# EasyEDA Pro project MasterCtrl_v1_0_4.eprj, board VicePCB
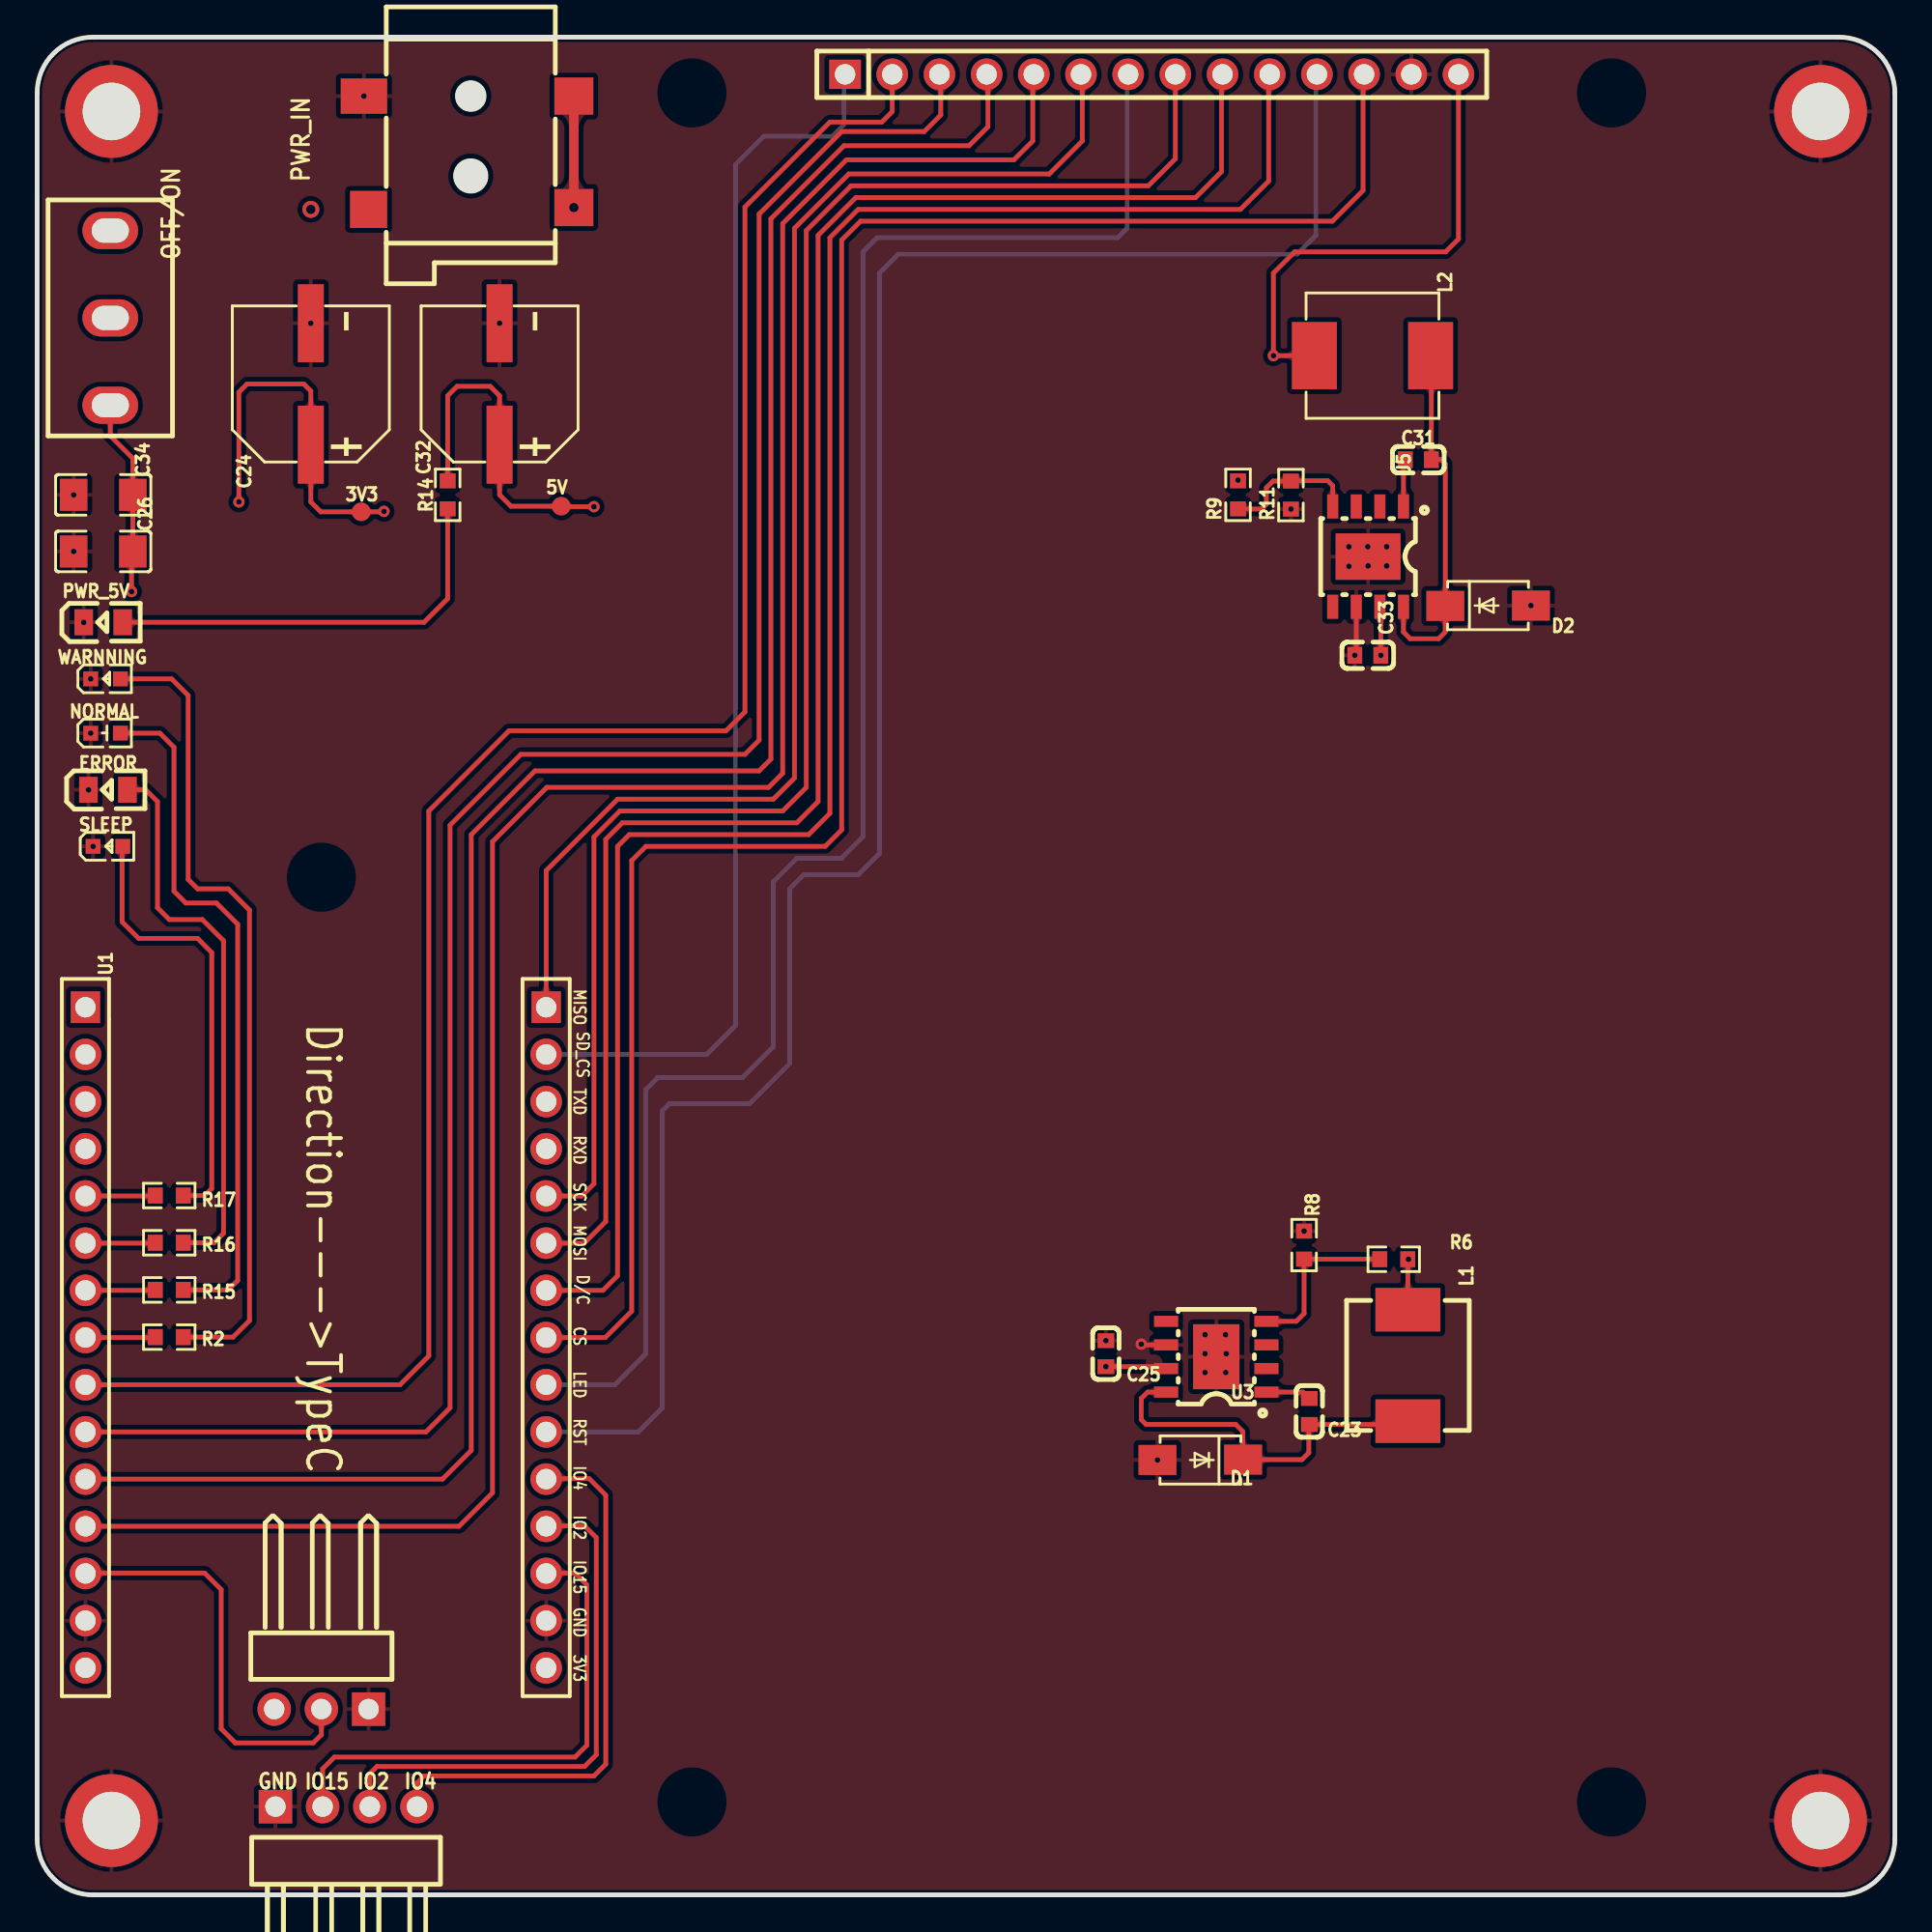
[diagram p6: board, top side]
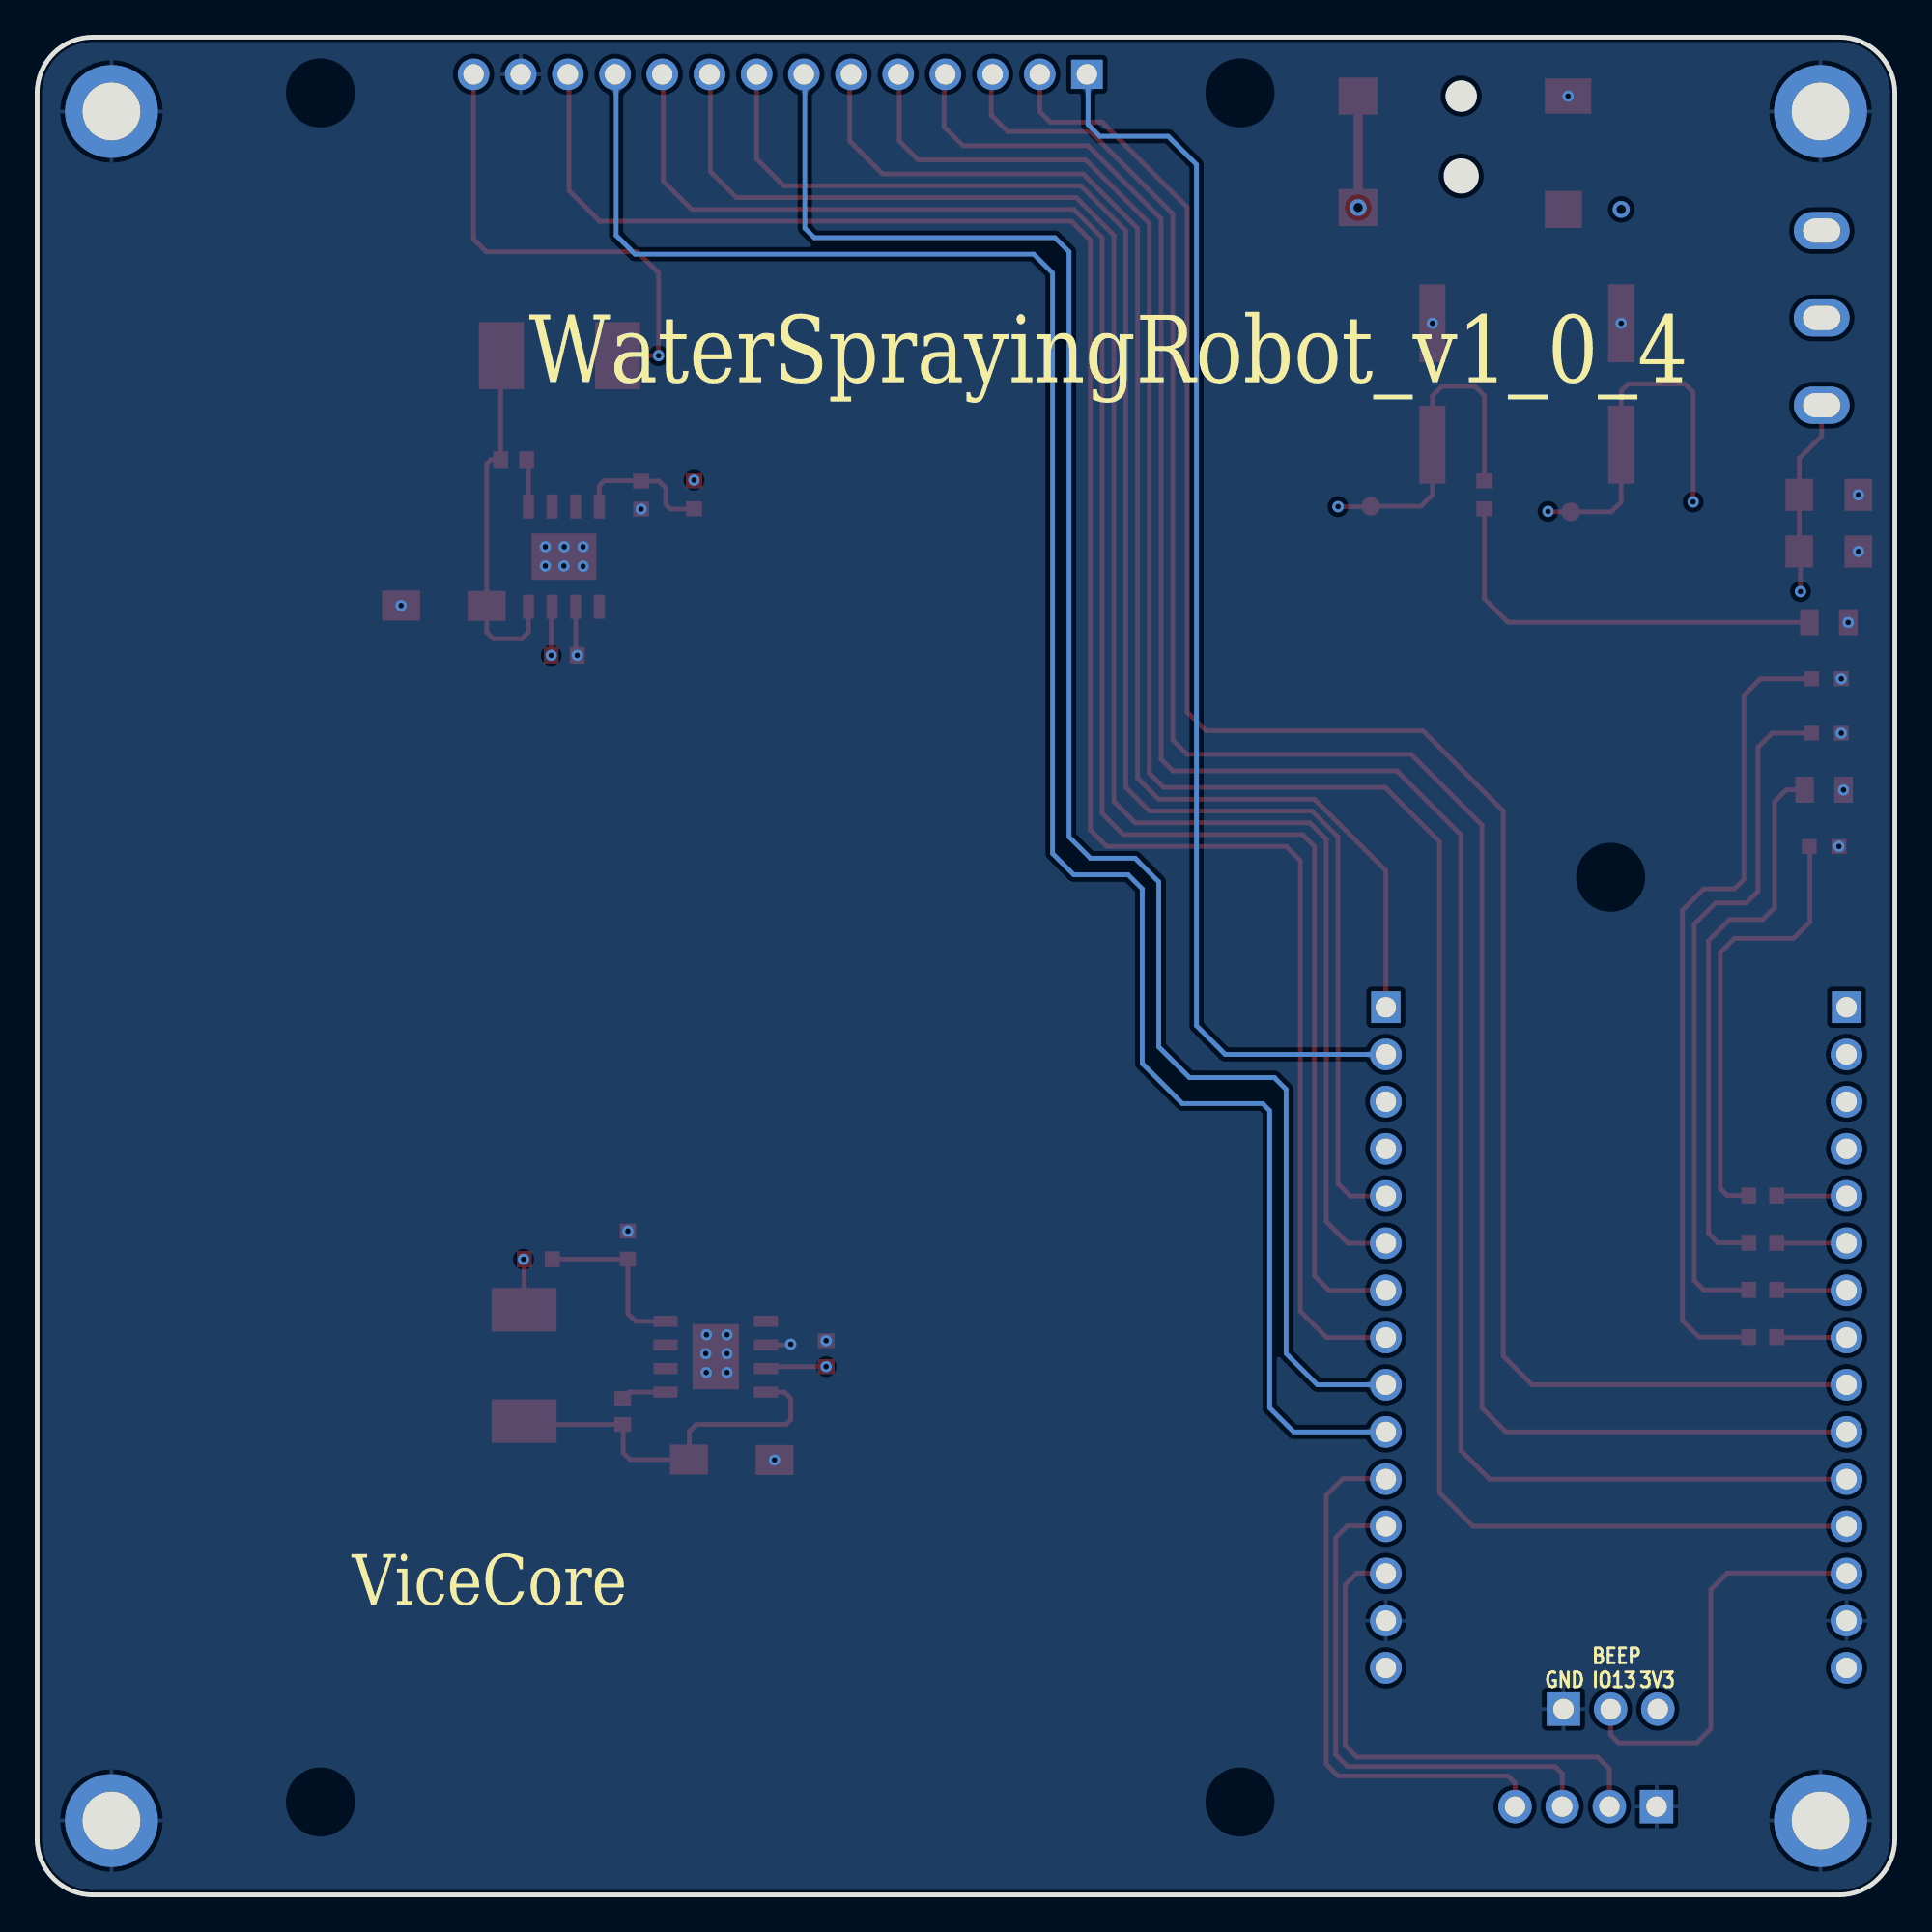
[diagram p7: board, bottom side, seen from below]

Outline 100 x 100 mm; copper layers: Top Layer, GND, PWR, Bottom Layer. Coordinates in mm from the lower left corner of the outline.
Outline path: 0,97 0,3 arc(0.88,0.88) 3,0 97,0 arc(99.12,0.88) 100,3 100,97 arc(99.12,99.12) 97,100 3,100 arc(0.88,99.12) 0,97
Stack: Top Layer 0.035mm 外层铜厚1oz / Dielectric1 0.2104mm 7628 RC49% 8.6mil / GND 0.0152mm 内层铜厚 / Dielectric2 1.065mm 1.1mm H/HOZ Copper / PWR 0.0152mm 内层铜厚 / Dielectric3 0.2104mm 7628 RC49% 8.6mil / Bottom Layer 0.035mm 外层铜厚1oz

## Design rules (mm)
template: JLCPCB Capability(Two Layers Board)
spacing copperThickness1oz (default): track to track 0.102, other pairs 0.152 to 0.3
spacing copperThickness2oz: track to track 0.203, other pairs 0.152 to 0.3
track width copperThickness1oz (default): min 0.127, default 0.254, max 2.54
track width copperThickness2oz: min 0.203, default 0.254, max 2.54
differential pair differentialPair (default): width min 0.127, default 0.254, max 2.54; gap min 0.152, default 0.152
via viaSize (default): diameter min 0.5, default 0.61, max 10; hole min 0.3, default 0.305, max 6.3

## Placement (name value [footprint] x y rotation side)
3V3  -  [Test-Point-0.5mm]  17.45 74.45 0 top
5V  -  [Test-Point-0.5mm]  28.21 74.75 270 top
C23  10nF  [C0603]  68.48 26.02 90 top
C24  220uF  [CAP-SMD_BD8.0-L8.3-W8.3-FD]  14.73 81.33 90 top
C25  100nF  [C0603]  57.53 29.13 90 top
C26  10uF  [C1206]  3.56 72.31 0 top
C31  10nF  [C0603]  74.35 77.25 180 top
C32  220uF  [CAP-SMD_BD8.0-L8.3-W8.3-FD]  24.89 81.33 90 top
C33  100nF  [C0603]  71.63 66.73 180 top
C34  10uF  [C1206]  3.56 75.36 0 top
D1  SS54  [SMA_L4.3-W2.6-LS5.0-FD]  62.61 23.42 0 top
D2  SS54  [SMA_L4.3-W2.6-LS5.0-FD]  78.1 69.39 180 top
ERROR  SZYY0805R  [LED0805-R-RD]  3.81 59.49 0 top
H1  PZ254R-11-03P  [HDR-TH_3P-P2.54-H-M-W10.4]  15.3 10 180 top
H2  PZ254R-11-05P  [HDR-TH_4P-P2.54-H-M-W10.4]  16.64 4.75 0 top
L1  10uH  [IND-SMD_L7.3-W6.8]  73.79 28.5 270 top
L2  15uH  [IND-SMD_L7.0-W6.6_FXL0630]  71.88 82.86 180 top
NOREF  -  [Pad_e25]  4 96 0 top
NOREF#2  -  [Pad_e31]  96 96 0 top
NOREF#3  -  [Pad_e29]  4 4 0 top
NOREF#4  -  [Pad_e30]  96 4 0 top
NORMAL  NCD0603G1  [LED0603-RD_1]  3.68 62.53 0 top
OFF/ON  SS-12D10L5  [SW-TH_SS-12D10L5]  3.94 84.89 270 top
PWR_5V  SZYY0805R  [LED0805-R-RD]  3.56 68.5 0 top
PWR_IN  DC050-T  [DC-IN_DC050-T]  23.24 93.78 270 top
R2  510  [R0603]  7.11 30.02 0 top
R6  10K  [R0603]  73.03 34.21 0 top
R8  5.9kΩ  [R0603]  68.2 34.98 270 top
R9  10K  [R0603]  64.64 75.36 90 top
R11  3.24kΩ  [R0603]  67.49 75.35 90 top
R14  1K  [R0603]  22.1 75.36 90 top
R15  510  [R0603]  7.11 32.56 0 top
R16  510  [R0603]  7.11 35.1 0 top
R17  510  [R0603]  7.11 37.64 0 top
SLEEP  MHT192WDT-ICE  [LED0603-RD]  3.81 56.44 0 top
U1  ZX-PM2.54-1-15PY  [HDR-TH_15P-P2.54-V-F]  2.6 30 270 top
U2  ZX-PM2.54-1-15PY  [HDR-TH_15P-P2.54-V-F]  27.4 30 270 top
U3  TPS5430DDAR  [ESOP-8_L4.9-W3.9-P1.27-LS6.0-TL-EP]  63.47 28.97 180 top
U5  TPS5430DDAR  [ESOP-8_L4.9-W3.9-P1.27-LS6.0-TL-EP]  71.64 72.04 270 top
U25  PM254-1-14-Z-8.5  [HDR-TH_14P-P2.54-V-F-1]  60 98 0 top
WARNNING  NCD0603Y2  [LED0603-RD]  3.68 65.46 0 top

## Footprints (pads in the part's own frame, mm; a bottom-side part is the same pattern mirrored in y, then rotated)
C0603
  rect 0.8x0.9 smd: 1(-0.7,0) 2(0.7,0)
C1206
  rect 1.485x1.728 smd: 1(-1.593,0) 2(1.593,0)
CAP-SMD_BD8.0-L8.3-W8.3-FD
  rect 4.2x1.4 smd: 1(-3.267,0) 2(3.267,0)
DC-IN_DC050-T
  rect 2x2.1 smd: 1(-3.05,5.65) 1(2.95,5.65)
  rect 1.9x2.5 smd: 2(-3.05,-5.65)
  rect 2x2 smd: 3(3.05,-5.4)
ESOP-8_L4.9-W3.9-P1.27-LS6.0-TL-EP
  rect 1.3x0.6 smd: 1(-2.7,1.905) 2(-2.7,0.635) 3(-2.7,-0.635) 4(-2.7,-1.905) 5(2.7,-1.905) 6(2.7,-0.635) 7(2.7,0.635) 8(2.7,1.905)
  rect 2.5x3.5 smd: 9(0,0)
HDR-TH_3P-P2.54-H-M-W10.4
  rect 1.8x1.8 hole 1.1: 1(-2.54,0)
  round 1.8 hole 1.1: 2(0,0) 3(2.54,0)
HDR-TH_4P-P2.54-H-M-W10.4
  rect 1.8x1.8 hole 1.1: 1(-3.81,0)
  round 1.8 hole 1.1: 2(-1.27,0) 3(1.27,0) 4(3.81,0)
HDR-TH_14P-P2.54-V-F-1
  rect 1.7x1.575 hole 1.1: 1(-16.51,0)
  round 1.7 hole 1.1: 2(-13.97,0) 3(-11.43,0) 4(-8.89,0) 5(-6.35,0) 6(-3.81,0) 7(-1.27,0) 8(1.27,0) 9(3.81,0) 10(6.35,0) 11(8.89,0) 12(11.43,0) 13(13.97,0) 14(16.51,0)
HDR-TH_15P-P2.54-V-F
  rect 1.7x1.575 hole 1.1: 1(-17.78,0)
  round 1.7 hole 1.1: 2(-15.24,0) 3(-12.7,0) 4(-10.16,0) 5(-7.62,0) 6(-5.08,0) 7(-2.54,0) 8(0,0) 9(2.54,0) 10(5.08,0) 11(7.62,0) 12(10.16,0) 13(12.7,0) 14(15.24,0) 15(17.78,0)
IND-SMD_L7.0-W6.6_FXL0630
  rect 2.424x3.62 smd: 1(3.128,0) 2(-3.128,0)
IND-SMD_L7.3-W6.8
  rect 2.35x3.5 smd: 1(-3,0) 2(3,0)
LED0603-RD
  rect 0.8x0.8 smd: 1(-0.799,0) 2(0.799,0)
LED0603-RD_1
  rect 0.8x0.8 smd: 1(-0.799,-0.004) 2(0.799,0.004)
LED0805-R-RD
  rect 1x1.399 smd: 1(1.05,0) 2(-1.05,0)
Pad_e25
  round 5 hole 3.1: 1(0,0)
Pad_e29
  round 5 hole 3.1: 1(0,0)
Pad_e30
  round 5 hole 3.1: 1(0,0)
Pad_e31
  round 5 hole 3.1: 1(0,0)
R0603
  rect 0.806x0.864 smd: 1(-0.753,0) 2(0.753,0)
SMA_L4.3-W2.6-LS5.0-FD
  rect 2.046x1.62 smd: 1(-2.304,-0.009) 2(2.304,0.009)
SW-TH_SS-12D10L5
  oval 2x3 hole 1.3x2: 1(-4.7,0) 2(0,0) 3(4.7,0)
Test-Point-0.5mm
  round 1 smd: 1(0,0)

## Nets
3V3_IN: 3V3.1 C24.1 H1.3 L1.1 R6.2 U2.15
5V_IN: 5V.1 C32.1 L2.1 R9.2 R14.2 U25.14
24V: C25.1 C26.2 C33.1 C34.2 OFF/ON.3 U3.7 U5.7
GND: C24.2 C25.2 C26.1 C32.2 C33.2 C34.1 D1.1 D2.1 ERROR.2 H1.1 H2.1 NOREF.1 NOREF#2.1 NOREF#3.1 NOREF#4.1 NORMAL.1 PWR_5V.2 PWR_IN.2 R8.1 R11.1 SLEEP.1 U1.14 U2.14 U3.6 U3.9 U5.6 U5.9 U25.13 WARNNING.1
VIN: U1.15
VIN_24V: OFF/ON.2 PWR_IN.1
BEEP: H1.2 U1.13
CTP_INT: U1.9 U25.2
CTP_RST: U1.11 U25.4
CTP_SCL: U1.12 U25.5
CTP_SDA: U1.10 U25.3
EN: U1.1
IO2: H2.3 U2.12
IO4: H2.4 U2.11
IO15: H2.2 U2.13
IO25: R2.1 U1.8
IO32: R16.1 U1.6
IO33: R15.1 U1.7
IO34: U1.4
IO35: R17.1 U1.5
LCD_CS: U2.8 U25.12
LCD_RS: U2.7 U25.10
LCD_RST: U2.10 U25.11
LED: U2.9 U25.7
MISO: U2.1 U25.6
MOSI: U2.6 U25.9
RXD: U2.4
SCK: U2.5 U25.8
SD_CS: U2.2 U25.1
TXD: U2.3
VN: U1.3
VP: U1.2
VSEN_3V3: R6.1 R8.2 U3.4
VSEN_5V: R9.1 R11.2 U5.4
$2N473: C23.2 U3.1
$2N474: C23.1 D1.2 L1.2 U3.8
$2N1336: C31.2 U5.1
$2N1337: C31.1 D2.2 L2.2 U5.8
$2N5426: PWR_5V.1 R14.1
$2N6328: R2.2 WARNNING.2
$2N6354: NORMAL.2 R15.2
$2N6380: ERROR.1 R16.2
$2N6406: R17.2 SLEEP.2

Pads without a net: OFF/ON 1; PWR_IN 3; U3 2 3 5; U5 2 3 5

## Via types
v1: diameter 0.61, hole 0.305, Top Layer to Bottom Layer, 38 vias
v2: diameter 0.914, hole 0.508, Top Layer to Bottom Layer, 2 vias

## Routing (per net, layer and track width the routed paths; a pad name or vN(x,y) marks a point on that pad's centre or on a via; arc(x,y) is an arc through that point)
3V3_IN: length 258.2
  Top Layer w0.254: v1(10.86,74.98) 10.86,80.89 11.3,81.33 14.35,81.33 14.73,80.95 C24.1 14.73,74.98 15.26,74.45 3V3.1 18.64,74.45 v1(18.67,74.47) ; R6.2 73.79,34.21 L1.1
  PWR w0.254: v1(10.86,74.98) 10.86,71.49 10.41,71.04 4.19,71.04 3.68,70.54 3.68,50.34 4.19,49.83 5.84,49.83 6.35,49.33 6.35,10.72 7.11,9.96 12.72,9.96 H1.3 12.76,8.37 13.21,7.93 26.67,7.93 27.43,8.69 27.43,12.19 U2.15 ; v1(73.82,34.21) 73.82,35.14 74.29,35.61 81.66,35.61 82.93,36.88 82.93,85.39 81.28,87.05 60.83,87.05 60.07,86.28 60.07,77.9 59.44,77.27 27.69,77.27 26.92,76.5 26.92,75.11 26.29,74.47 v1(18.67,74.47)
5V_IN: length 88.8
  Top Layer w0.254: U25.14 76.51,89.13 75.82,88.44 67.69,88.44 66.55,87.3 v1(66.55,82.86) L2.1 ; v1(29.97,74.73) 28.23,74.73 5V.1 25.5,74.75 24.89,75.36 C32.1 24.89,80.7 24.38,81.2 22.61,81.2 22.1,80.7 R14.2
  PWR w0.254: v1(29.97,74.73) 30.61,74.73 30.86,74.98 30.86,75.87 31.15,76.16 v1(64.64,76.16) 64.64,82.35 65.15,82.86 v1(66.55,82.86)
24V: length 150.6
  Top Layer w0.254: U3.7 60.67,28.43 v1(57.53,28.43) ; v1(72.33,66.73) 72.33,69.29 U5.7 ; v1(5.08,70.16) 5.08,72.25 C26.2 C34.2 5.15,77.33 3.94,78.54 OFF/ON.3
  PWR w0.254: v1(72.33,66.73) 72.33,62.09 71.25,61.01 34.55,61.01 ; v1(57.53,28.43) 36.51,28.43 34.54,30.4 34.54,64.57 32.64,66.47 6.22,66.47 5.08,67.61 v1(5.08,70.16)
GND: length 4
  Top Layer w0.254: v1(70.93,66.73) 71.01,66.81 U5.6 ; U3.6 59.48,29.6 v1(59.44,29.64)
  vias: v1(1.96,75.36) v1(1.96,72.31) v1(2.51,68.49) v1(2.77,59.48) v1(2.88,65.46) v1(2.88,62.53) v1(3.01,56.44) v1(14.73,84.6) v1(17.59,96.83) v1(24.89,84.6) v1(57.53,29.83) v1(60.31,23.41) v1(62.87,30.15) v1(62.87,29.13) v1(62.87,28.12) v1(63.97,30.15) v1(64.01,29.13) v1(63.98,28.12) v1(67.49,74.6) v1(68.2,35.73) v1(70.61,72.57) v1(70.61,71.52) v1(71.63,72.57) v1(71.64,71.53) v1(72.64,72.57) v1(72.64,71.53) v1(80.41,69.4)
VIN_24V: length 35.3
  Top Layer w0.508: v2(28.89,90.83) PWR_IN.1
  PWR w0.508: v2(28.89,90.83) 28.79,90.73 v2(14.73,90.73) 10.16,90.73 8.64,89.2 8.64,86.03 7.49,84.89 OFF/ON.2
BEEP: length 22.4
  Top Layer w0.254: U1.13 2.62,17.32 9.02,17.32 9.91,16.43 9.91,8.94 10.67,8.18 14.86,8.18 15.3,8.62 H1.2
CTP_INT: length 106.9
  Top Layer w0.254: U1.9 19.53,27.46 21.08,29.01 21.08,58.34 25.4,62.66 37.08,62.66 38.1,63.68 38.1,90.86 42.67,95.43 45.47,95.43 46.03,95.99 U25.2
CTP_RST: length 118
  Top Layer w0.254: U1.11 21.82,22.38 23.37,23.93 23.37,57.07 26.8,60.5 38.86,60.5 39.5,61.14 39.5,90.22 43.43,94.16 50.16,94.16 51.18,95.17 51.18,97.93 U25.4
CTP_SCL: length 123.4
  Top Layer w0.254: U1.12 22.71,19.84 24.51,21.64 24.51,56.69 27.43,59.61 39.37,59.61 40.13,60.38 40.13,89.97 43.56,93.4 52.58,93.4 53.59,94.41 53.59,97.94 U25.5
CTP_SDA: length 112.6
  Top Layer w0.254: U1.10 20.93,24.92 22.22,26.21 22.22,57.58 26.03,61.39 38.1,61.39 38.86,62.15 38.86,90.47 43.31,94.92 47.75,94.92 48.64,95.81 48.64,97.93 U25.3
IO2: length 29
  Top Layer w0.254: U2.12 27.42,19.86 29.46,19.86 30.1,19.23 30.1,7.54 29.46,6.91 18.29,6.91 17.91,6.53 H2.3
IO4: length 29.9
  Top Layer w0.254: H2.4 20.45,6.02 20.83,6.4 29.97,6.4 30.61,7.04 30.61,21.51 29.72,22.4 27.42,22.4 U2.11
IO15: length 27.9
  Top Layer w0.254: H2.2 15.37,6.78 16,7.42 28.96,7.42 29.59,8.05 29.59,16.69 28.96,17.32 27.42,17.32 U2.13
IO25: length 3.8
  Top Layer w0.254: R2.1 6.34,30 U1.8
IO32: length 3.8
  Top Layer w0.254: R16.1 6.34,35.08 U1.6
IO33: length 3.8
  Top Layer w0.254: R15.1 6.34,32.54 U1.7
IO35: length 3.8
  Top Layer w0.254: R17.1 6.34,37.62 U1.5
LCD_CS: length 108.6
  Top Layer w0.254: U2.8 30.58,30 32,31.42 32,55.68 32.77,56.44 42.42,56.44 43.31,57.33 43.31,89.08 44.32,90.09 69.72,90.09 71.37,91.75 71.37,97.94 U25.12
LCD_RS: length 101.1
  Top Layer w0.254: U2.7 30.46,32.54 31.24,33.33 31.24,56.44 31.88,57.07 41.53,57.07 42.67,58.22 42.67,89.2 44.2,90.73 64.77,90.73 66.29,92.25 66.29,97.94 U25.10
LCD_RST: length 110
  Bottom Layer w0.254: U25.11 68.83,97.94 68.83,89.33 67.82,88.32 46.35,88.32 45.34,87.3 45.34,56.06 44.2,54.92 41.28,54.92 40.51,54.15 40.51,44.75 38.35,42.6 34.04,42.6 33.66,42.22 33.66,26.21 32.36,24.92 U2.10
LED: length 97.4
  Bottom Layer w0.254: U2.9 31.09,27.46 32.77,29.13 32.77,43.36 33.4,43.99 37.97,43.99 39.62,45.64 39.62,54.53 40.89,55.8 43.31,55.8 44.45,56.95 44.45,88.44 45.21,89.2 58.17,89.2 58.67,89.71 58.67,97.94 U25.7
MISO: length 73.4
  Top Layer w0.254: U2.1 27.4,55.14 31.24,58.98 39.62,58.98 40.77,60.12 40.77,89.71 43.69,92.63 54.48,92.63 56.26,94.41 56.26,97.93 U25.6
MOSI: length 95.4
  Top Layer w0.254: U25.9 63.75,97.94 63.75,92.76 62.36,91.36 44.07,91.36 42.04,89.33 42.04,58.85 40.89,57.71 31.5,57.71 30.61,56.82 30.61,36.25 29.44,35.08 U2.6
SCK: length 90
  Top Layer w0.254: U2.5 29.31,37.62 29.97,38.28 29.97,56.95 31.37,58.34 40.13,58.34 41.4,59.61 41.4,89.59 43.81,92 59.82,92 61.27,93.45 U25.8
SD_CS: length 66.6
  Bottom Layer w0.254: U2.2 36.04,45.24 37.59,46.79 37.59,93.14 39.12,94.67 42.8,94.67 43.43,95.3 43.43,97.94 U25.1
VSEN_3V3: length 9.2
  Top Layer w0.254: R6.1 72.26,34.22 R8.2 68.2,31.29 67.78,30.87 U3.4
VSEN_5V: length 7.5
  Top Layer w0.254: U5.4 69.74,75.85 69.47,76.12 67.51,76.12 R11.2 66.53,76.1 66.17,75.74 66.17,74.85 65.91,74.6 64.65,74.6 R9.1
$2N473: length 2.4
  Top Layer w0.254: U3.1 68.14,27.06 C23.2
$2N474: length 20.5
  Top Layer w0.254: U3.8 59.78,27.06 59.44,26.72 59.44,25.58 59.69,25.32 64.52,25.32 64.9,24.94 64.9,23.45 D1.2 68.08,23.43 68.45,23.8 68.45,25.29 C23.1 73.61,25.32 L1.2
$2N1336: length 2.6
  Top Layer w0.254: C31.2 73.55,77.16 U5.1
$2N1337: length 19.4
  Top Layer w0.254: L2.2 75.05,82.82 C31.1 75.06,77.27 75.56,77.27 75.8,77.03 D2.2 75.8,67.98 75.44,67.61 73.91,67.61 73.55,67.98 U5.8
$2N5426: length 22.9
  Top Layer w0.254: PWR_5V.1 20.83,68.5 22.1,69.77 R14.1
$2N6328: length 43.9
  Top Layer w0.254: WARNNING.2 7.24,65.46 8.13,64.57 8.13,54.66 8.64,54.15 10.29,54.15 11.43,53.01 11.43,30.91 10.54,30.02 R2.2
$2N6354: length 37.4
  Top Layer w0.254: NORMAL.2 4.49,62.53 6.6,62.53 7.37,61.77 7.37,54.03 8,53.39 9.65,53.39 10.8,52.25 10.8,33.07 10.29,32.56 R15.2
$2N6380: length 30
  Top Layer w0.254: ERROR.1 5.84,59.49 6.48,58.85 6.48,53.14 7.11,52.5 8.89,52.5 10.03,51.36 10.03,35.61 9.53,35.1 R16.2
$2N6406: length 24
  Top Layer w0.254: R17.2 9.02,37.64 9.4,38.02 9.4,50.72 8.64,51.49 5.46,51.49 4.57,52.38 4.57,56.4 SLEEP.2

## Copper pours and planes (outline as drawn; the poured copper is in the pictures)
GND on Top Layer: -23.37,116.64 129.54,116.64 129.54,-30.56 -23.37,-30.56
GND on Bottom Layer: -33.27,123.11 145.03,123.11 145.03,-40.46 -33.27,-40.46
GND on GND: -19.94,115.75 115.95,115.75 115.95,-22.05 -19.94,-22.05

Small or netless copper shapes (teardrops, artwork), in the pictures only: 107 on Top Layer, 6 on Bottom Layer, 18 on PWR

## Text on the board
Bottom Silkscreen Layer: 3V3 | BEEP / IO13 | GND | ViceCore | WaterSprayingRobot_v1_0_4
Top Silkscreen Layer: MISO | TXD | RXD | SCK | MOSI | CS | LED | RST | IO4 | IO2 | IO15 | GND | 3V3 | SD_CS | D/C | Direction--->TypeC
